# Altium schematic sheet 07-AUDIO_INNER.SchDoc
size C
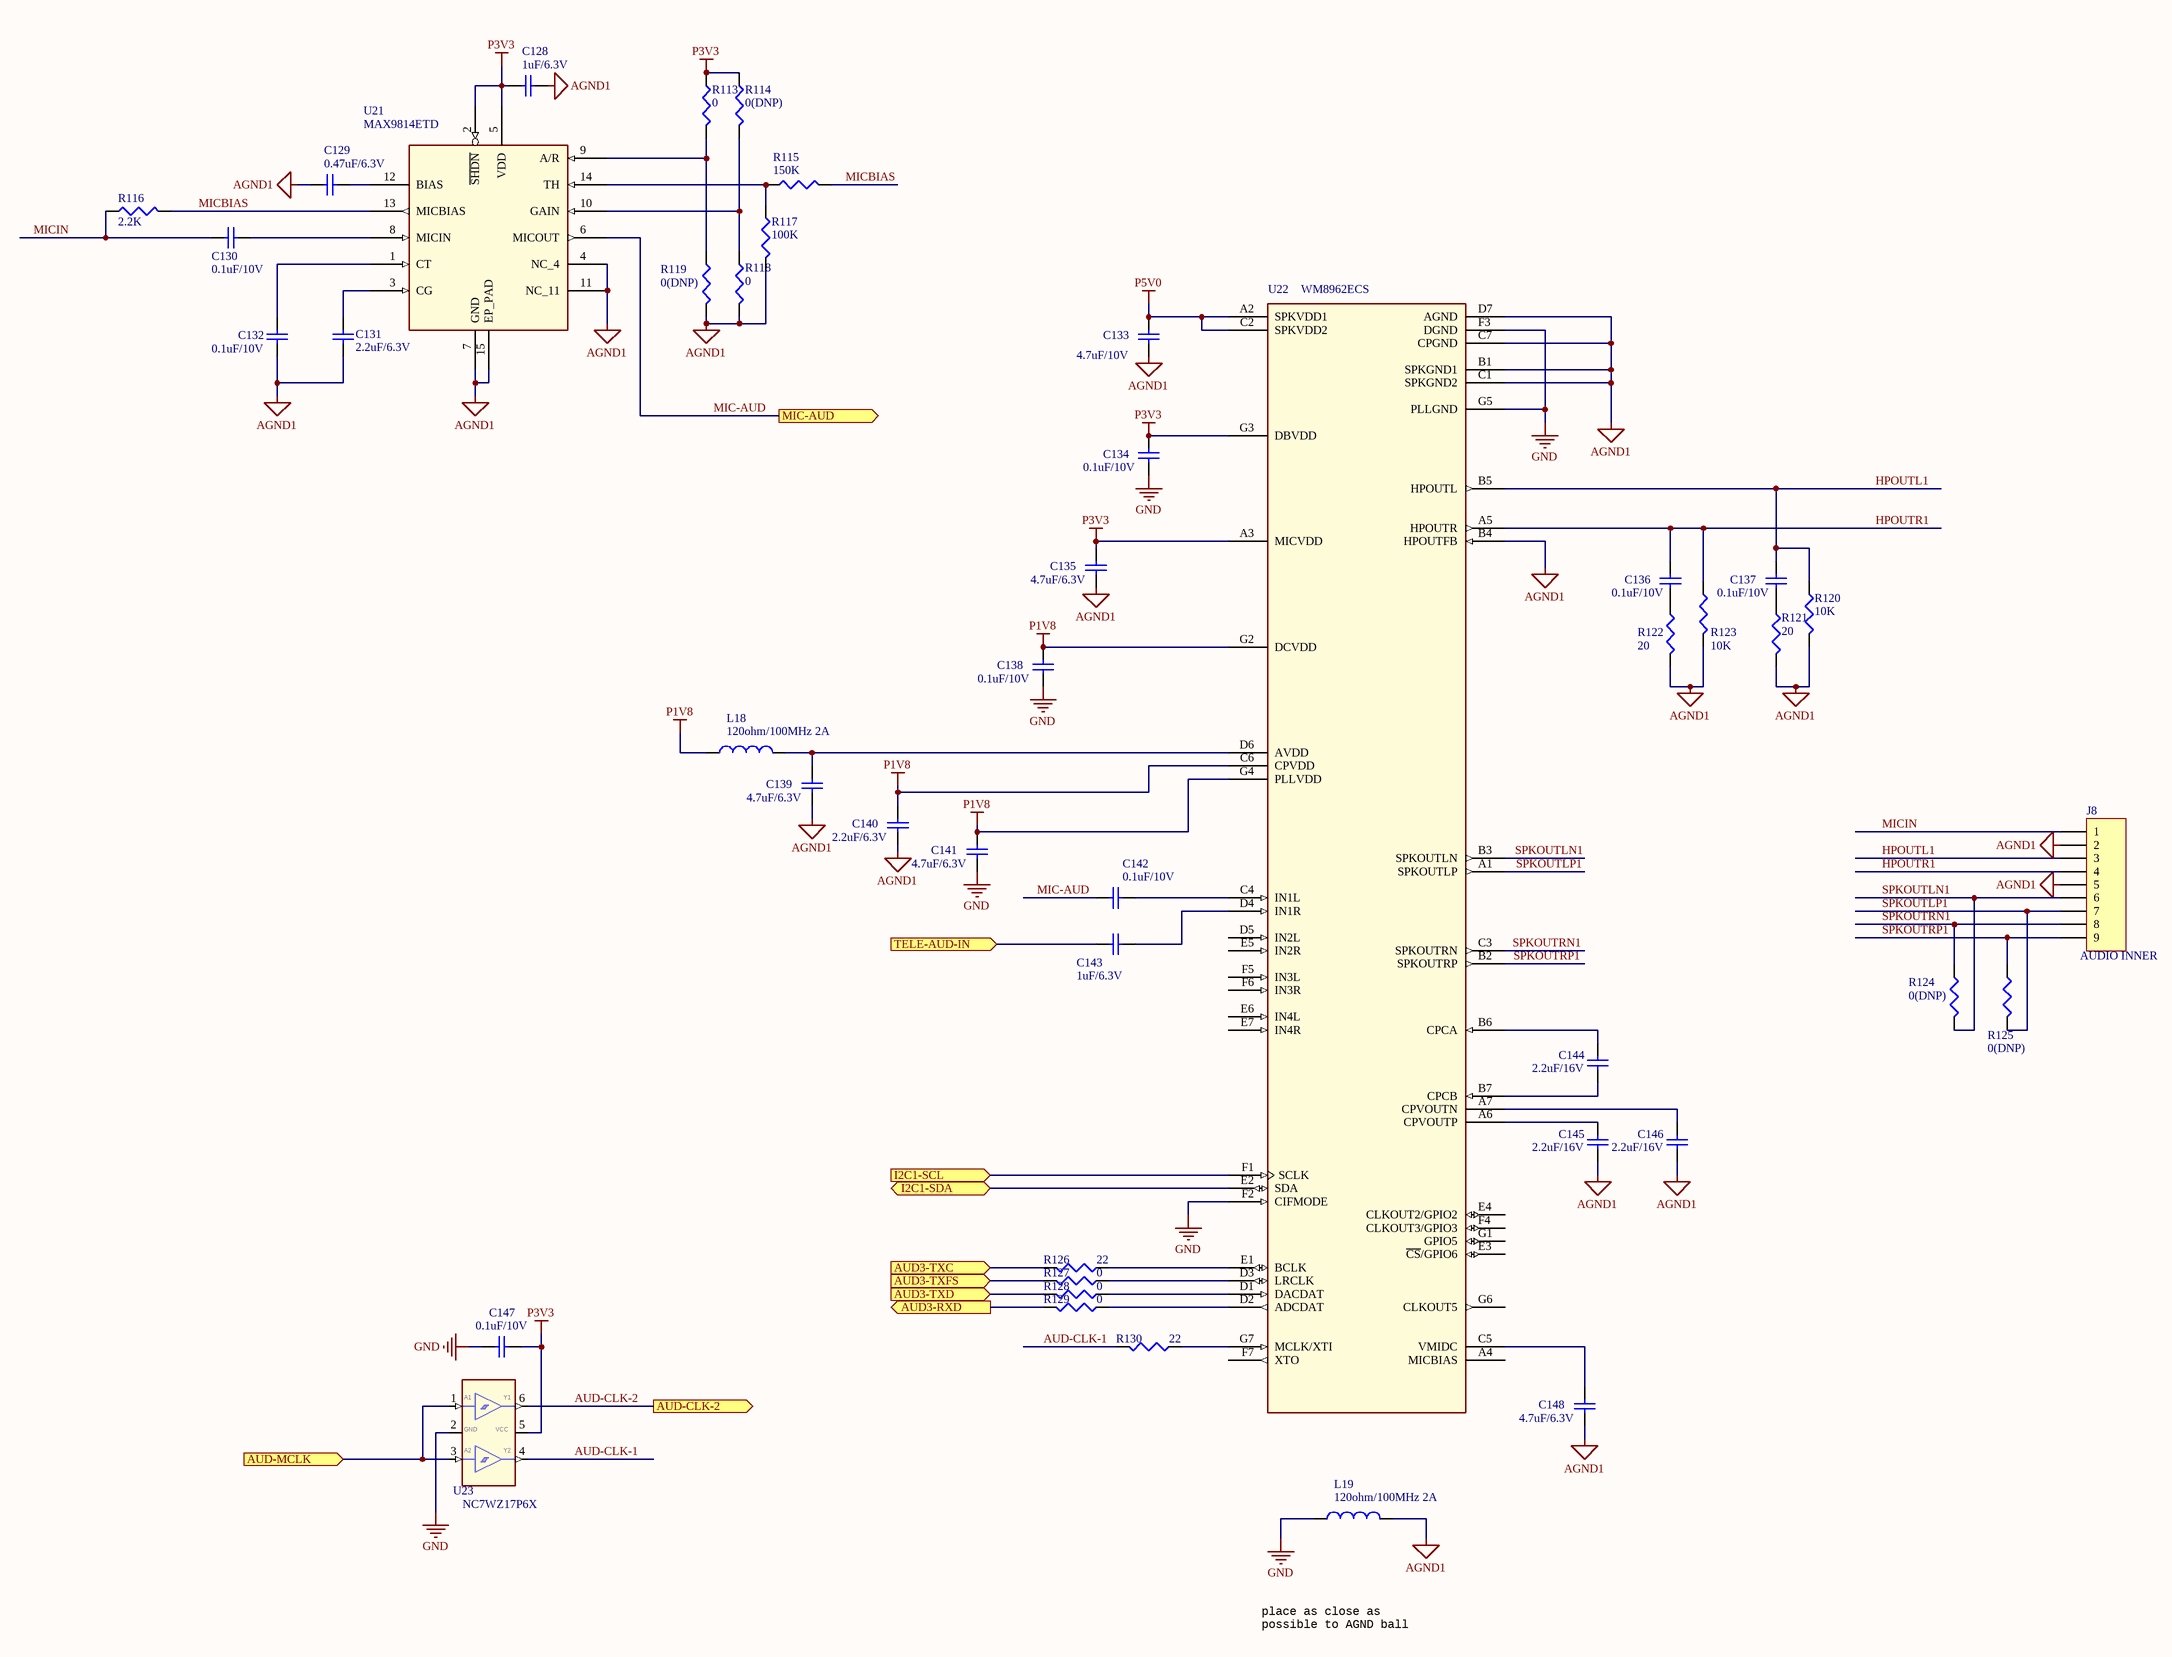
[diagram p0: 07-AUDIO_INNER.SchDoc]

## Parts
C128  1uF/6.3V  [0402]
C129  0.47uF/6.3V  [0402]
C130  0.1uF/10V  [0402]
C131  2.2uF/6.3V  [0603]
C132  0.1uF/10V  [0402]
C133  4.7uF/10V  [0805]
C134  0.1uF/10V  [0402]
C135  4.7uF/6.3V  [0603]
C136  0.1uF/10V  [0402]
C137  0.1uF/10V  [0402]
C138  0.1uF/10V  [0402]
C139  4.7uF/6.3V  [0603]
C140  2.2uF/6.3V  [0603]
C141  4.7uF/6.3V  [0603]
C142  0.1uF/10V  [0402]
C143  1uF/6.3V  [0402]
C144  2.2uF/16V  [0603]
C145  2.2uF/16V  [0603]
C146  2.2uF/16V  [0603]
C147  0.1uF/10V  [0402]
C148  4.7uF/6.3V  [0603]
J8  AUDIO INNER  [CON-9PIN]
L18  120ohm/100MHz 2A  [0603]
L19  120ohm/100MHz 2A  [0603]
R113  0  [0402]
R114  0(DNP)  [0402]
R115  150K  [0402]
R116  2.2K  [0402]
R117  100K  [0402]
R118  0  [0402]
R119  0(DNP)  [0402]
R120  10K  [0402]
R121  20  [0402]
R122  20  [0402]
R123  10K  [0402]
R124  0(DNP)  [0603]
R125  0(DNP)  [0603]
R126  22  [0402]
R127  0  [0402]
R128  0  [0402]
R129  0  [0402]
R130  22  [0402]
U21  MAX9814ETD  [TDFN14]
U22  WM8962ECS  [BGA49]
U23  NC7WZ17P6X  [SC70-6]

## Ports
AUD3-RXD (out), AUD3-TXC (in), AUD3-TXD (in), AUD3-TXFS (in), AUD-CLK-2 (out), AUD-MCLK (in), I2C1-SCL (in), I2C1-SDA (bidir), MIC-AUD (out), TELE-AUD-IN (in)

## Nets
AGND1: C128.1 C129.2 C131.2 C132.2 C133.1 C135.1 C139.1 C140.1 C145.1 C146.1 C148.1 J8.2 J8.5 L19.2 R117.2 R118.2 R119.2 R120.2 R121.2 R122.2 R123.2 U21.4(NC_4) U21.7(GND) U21.11(NC_11) U21.15(EP_PAD) U22.B1(SPKGND1) U22.B4(HPOUTFB) U22.C1(SPKGND2) U22.C7(CPGND) U22.D7(AGND)
GND: C134.1 C138.1 C141.1 C147.2 L19.1 U22.F2(CIFMODE) U22.F3(DGND) U22.G5(PLLGND) U23.2(GND)
P1V8: C138.2 C140.2 C141.2 L18.1 U22.C6(CPVDD) U22.G2(DCVDD) U22.G4(PLLVDD)
P3V3: C128.2 C134.2 C135.2 C147.1 R113.1 R114.1 U21.2(~{SHDN}) U21.5(VDD) U22.A3(MICVDD) U22.G3(DBVDD) U23.5(VCC)
P5V0: C133.2 U22.A2(SPKVDD1) U22.C2(SPKVDD2)
AUD3-RXD: R129.2 ; port AUD3-RXD
AUD3-TXC: R126.2 ; port AUD3-TXC
AUD3-TXD: R128.2 ; port AUD3-TXD
AUD3-TXFS: R127.2 ; port AUD3-TXFS
AUD-CLK-1: R130.2 U23.4(Y2)
AUD-CLK-2: U23.6(Y1) ; port AUD-CLK-2
AUD-MCLK: U23.1(A1) U23.3(A2) ; port AUD-MCLK
HPOUTL1: C137.2 J8.3 R120.1 U22.B5(HPOUTL)
HPOUTR1: C136.2 J8.4 R123.1 U22.A5(HPOUTR)
I2C1-SCL: U22.F1(SCLK) ; port I2C1-SCL
I2C1-SDA: U22.E2(SDA) ; port I2C1-SDA
MIC-AUD: C142.2 U21.6(MICOUT) ; port MIC-AUD
MICBIAS: R115.2 R116.2 U21.13(MICBIAS)
MICIN: C130.2 J8.1 R116.1
SPKOUTLN1: J8.6 R124.2 U22.B3(SPKOUTLN)
SPKOUTLP1: J8.7 R125.2 U22.A1(SPKOUTLP)
SPKOUTRN1: J8.8 R124.1 U22.C3(SPKOUTRN)
SPKOUTRP1: J8.9 R125.1 U22.B2(SPKOUTRP)
TELE-AUD-IN: C143.2 ; port TELE-AUD-IN
NetC129_1: C129.1 U21.12(BIAS)
NetC130_1: C130.1 U21.8(MICIN)
NetC131_1: C131.1 U21.3(CG)
NetC132_1: C132.1 U21.1(CT)
NetC136_1: C136.1 R122.1
NetC137_1: C137.1 R121.1
NetC139_2: C139.2 L18.2 U22.D6(AVDD)
NetC142_1: C142.1 U22.C4(IN1L)
NetC143_1: C143.1 U22.D4(IN1R)
NetC144_1: C144.1 U22.B7(CPCB)
NetC144_2: C144.2 U22.B6(CPCA)
NetC145_2: C145.2 U22.A6(CPVOUTP)
NetC146_2: C146.2 U22.A7(CPVOUTN)
NetC148_2: C148.2 U22.C5(VMIDC)
NetR113_2: R113.2 R119.1 U21.9(A/R)
NetR114_2: R114.2 R118.1 U21.10(GAIN)
NetR115_1: R115.1 R117.1 U21.14(TH)
NetR126_1: R126.1 U22.E1(BCLK)
NetR127_1: R127.1 U22.D3(LRCLK)
NetR128_1: R128.1 U22.D1(DACDAT)
NetR129_1: R129.1 U22.D2(ADCDAT)
NetR130_1: R130.1 U22.G7(MCLK/XTI)

Not connected (* = marked no-connect by the designer): U22 A4(MICBIAS) D5(IN2L) E3(~{CS}/GPIO6) E4(CLKOUT2/GPIO2) E5(IN2R) E6(IN4L) E7(IN4R) F4(CLKOUT3/GPIO3) F5(IN3L) F6(IN3R) F7(XTO) G1(GPIO5) G6(CLKOUT5)

## Notes on the sheet
- place as close as
  possible to AGND ball

## Library data of the parts
C128-C148 = Cap: Capacitor; Published: 8-Jun-2000; LatestRevisionDate: 17-Jul-2002; LatestRevisionNote: Re-released for DXP Platform.; PackageReference: RAD-0.3; Publisher: Altium Limited; PackageDescription: Radial Cap, Thru-Hole; 2 Leads; 0.3 in Pin Spacing
J8 = Header 9: Header, 9-Pin; LatestRevisionDate: 17-Jul-2002; LatestRevisionNote: Re-released for DXP Platform.; Publisher: Altium Limited
L18 L19 = Inductor: Code_IEC: 1005; Value: 300ohm/100MHz BEAD; Published: 8-Jun-2000; LatestRevisionDate: 29-May-2009; LatestRevisionNote: IPC-7351 Footprint Added.; PackageReference: 0402-A; Publisher: Altium Limited; PackageDescription: Chip Inductor; Code_JEITA: 0402
R113-R130 = CR16-1003FM
U21 = MAX9814_TDFN14: IC LIN AGC AMP 2.7-5.5V TDFN14; CAD_APPROVED: Yes; MFG_PN01: MAX9814ETD+T; MFG_NAME01: MAXIM; AGILE_PN: 315-79082; CLASS: IC; HEIGHT: 0.8MM; ROHS: Yes
U22 = WM8962_BGA_49P_CUST: IC AUDIO CODEC 24BIT DAC 2 CH ADC 1.8V BGA49; AGILE_PN: 315-79434; MFG_NAME01: WOLFSON MICROELECTRONICS; MFG_PN01: WM8962ECSN/R; CAD_APPROVED: Yes; FPLIST: bga49_0p5_3p62x4,bga49_0p5_3p62x4_smdp; CLASS: IC; ROHS: Yes; HEIGHT: 0.75MM
U23 = NC7WZ17: IC BUF DUAL SCHMITT 1.65-5.5V SC70-6; AGILE_PN: 312-79527; MFG_NAME01: FAIRCHILD; CAD_APPROVED: Yes; CLASS: IC; MFG_PN01: NC7WZ17P6X; ROHS: Yes; HEIGHT: 1.1MM